# Altium project TC377TP_MK1.PrjPcb
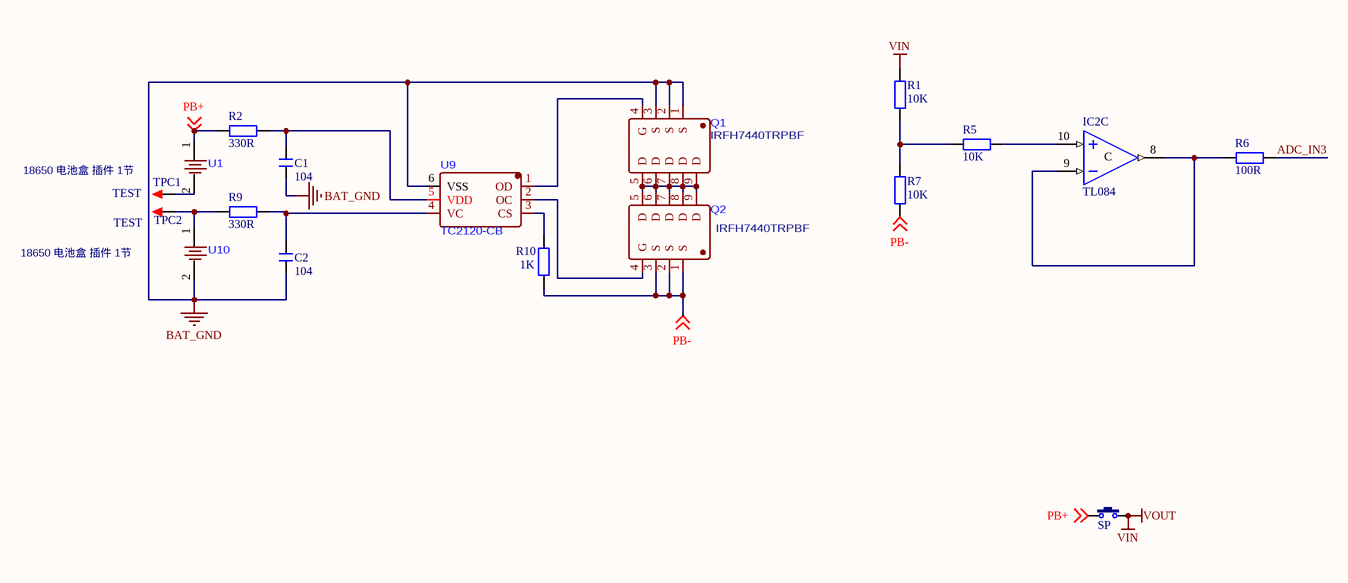
[diagram p0: BAT.SchDoc]
5 sheets, 291 parts. Net scope: global (net labels, ports and power ports of the same name join across sheets).
Board file: PCB_CAR.PcbDoc
Sheets:
  BAT.SchDoc
  MOTOR_DRV.SchDoc
  OTHER.SchDoc
  TC377TP_1.SchDoc
  TC377TP_2.SchDoc

## Sheet BAT.SchDoc
size A3; SheetNumber: 1; SheetTotal: 5

### Parts
C1  104  [C 0805_L]
C2  104  [C 0805_L]
IC2  TL084  [SOP14_N]  (part C of 4)
Q1  IRFH7440TRPBF  [PQFN-8P_L5.8-W4.9-P1.27-LS6.0-BL]
Q2  IRFH7440TRPBF  [PQFN-8P_L5.8-W4.9-P1.27-LS6.0-BL]
R1  10K  [R 0805_L]
R2  330R  [R 0805_L]
R5  10K  [R 0805_L]
R6  100R  [R 0805_L]
R7  10K  [R 0805_L]
R9  330R  [R 0805_L]
R10  1K  [R 0805_L]
SP  6x6x5  [KEY-TH_CN-KCD11]  (value not drawn)
TPC1  TEST  [TEST 1.6]
TPC2  TEST  [TEST 1.6]
U1  18650 电池盒 插件 1节  [BAT-TH_18650-C9900004923]
U9  TC2120-CB  [SOT23-6L]
U10  18650 电池盒 插件 1节  [BAT-TH_18650-C9900004923]

### Nets
BAT_GND: C1.1 C2.1 Q1.1(S) Q1.2(S) Q1.3(S) U9.6(VSS) U10.2
PB-: Q2.1(S) Q2.2(S) Q2.3(S) R7.2 R10.2 ; off-sheet PB-  [project net CORE_GND]
VIN: R1.1 SP.2  [also labelled VOUT]
ADC_IN3: R6.1
PB+: R2.2 SP.1 U1.1 ; off-sheet PB+
NetC1_2: C1.2 R2.1 U9.5(VDD)
NetC2_2: C2.2 R9.1 U9.4(VC)
NetIC2_8: IC2.8(OUT) IC2.9(IN-) R6.2
NetIC2_10: IC2.10(IN+) R5.1
NetQ1_4: Q1.4(G) U9.1(OD)
NetQ1_5: Q1.5(D) Q1.6(D) Q1.7(D) Q1.8(D) Q1.9(D) Q2.5(D) Q2.6(D) Q2.7(D) Q2.8(D) Q2.9(D)
NetQ2_4: Q2.4(G) U9.2(OC)
NetR1_2: R1.2 R5.2 R7.1
NetR9_2: R9.2 TPC2.1 U10.1
NetR10_1: R10.1 U9.3(CS)
NetTPC1_1: TPC1.1 U1.2

### Notes on the sheet
- (in symbol TL084, part C) C

### Library data of the parts
C1 C2 = C: 无极性贴片电容; 版权归属: 源创客; 材质: X7R; BOM名称: 无极性贴片电容; 学习资源: www.ooocke.com
IC2 = TL084: 4路运放; 版权归属: 源创客; BOM名称: 4路运放; 学习资源: www.ooocke.com
R1 R2 R5-R7 R9 R10 = R: 贴片电阻; 版权归属: 源创客; BOM名称: 贴片电阻; 学习资源: www.ooocke.com
SP = TSW DIP-2Pin-6x6: 2脚直插6x6轻触开关; BOM名称: 2脚轻触开关; 版权归属: 源创客; 学习资源: www.ooocke.com
TPC1 TPC2 = TEST: 测试点; 版权归属: 源创客; BOM名称: 测试点; 学习资源: www.ooocke.com

## Sheet MOTOR_DRV.SchDoc
size A3; SheetNumber: 2; SheetTotal: 5
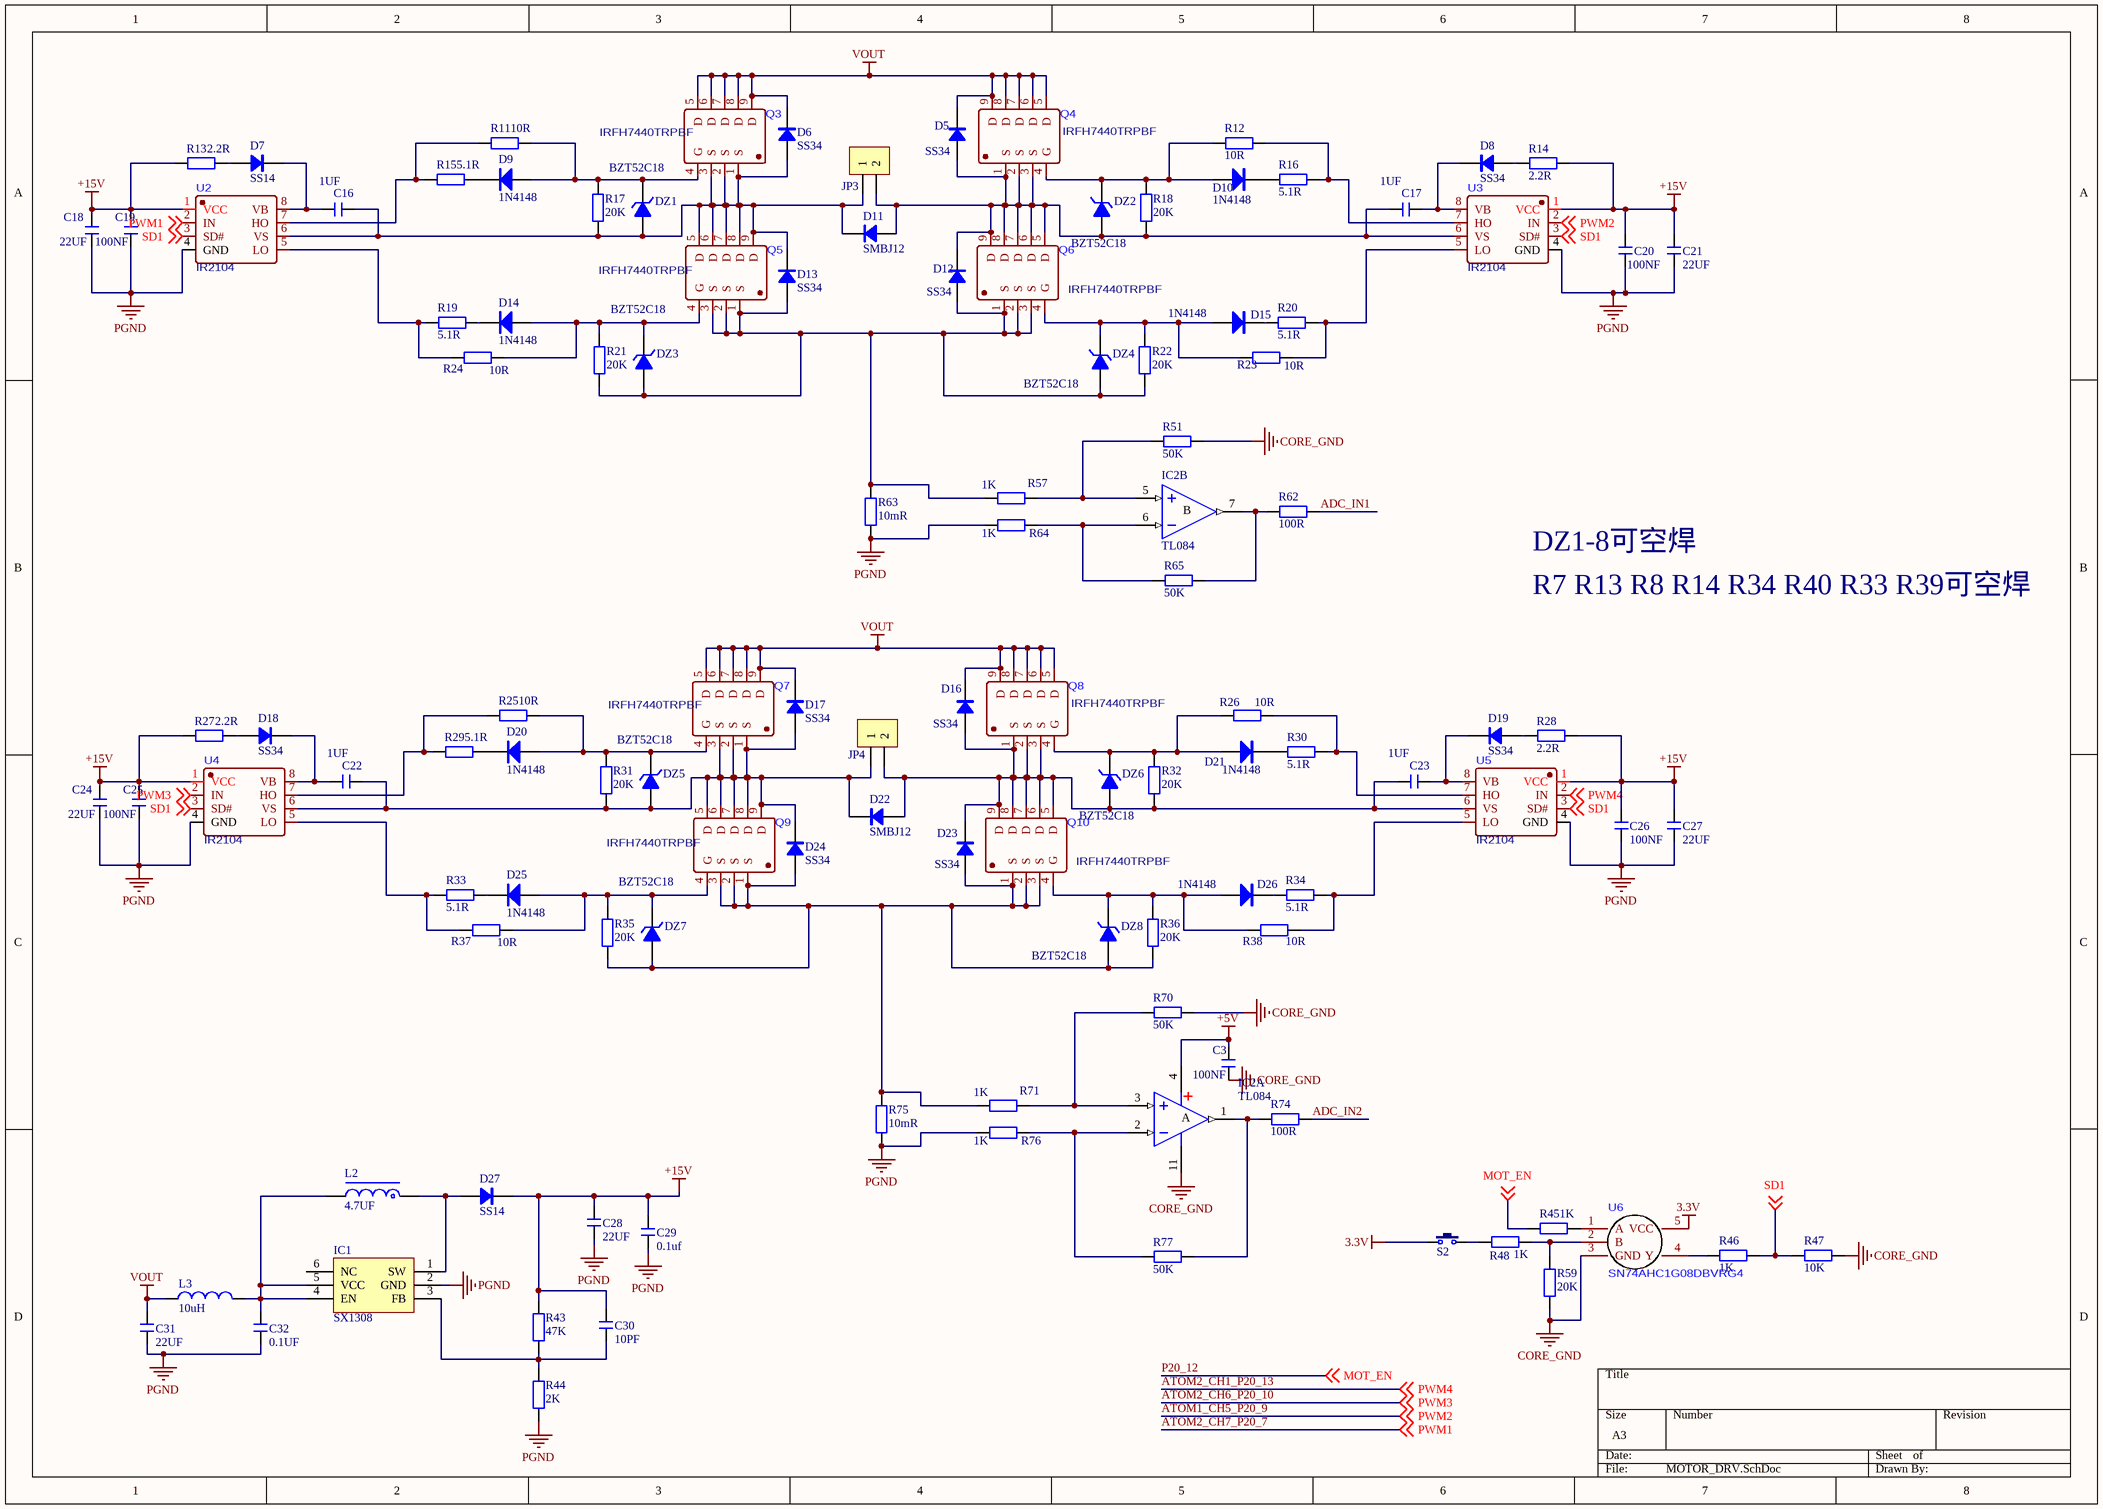
[diagram p1: MOTOR_DRV.SchDoc]

### Parts
C3  100NF  [C 0805_L]
C16  1UF  [C 1206_L]
C17  1UF  [C 1206_L]
C18  22UF  [C 0805_L]
C19  100NF  [C 0805_L]
C20  100NF  [C 0805_L]
C21  22UF  [C 0805_L]
C22  1UF  [C 1206_L]
C23  1UF  [C 1206_L]
C24  22UF  [C 0805_L]
C25  100NF  [C 0805_L]
C26  100NF  [C 0805_L]
C27  22UF  [C 0805_L]
C28  22UF  [C 1206_L]
C29  0.1uf  [C 0805_L]
C30  10PF  [C 0603_L]
C31  22UF  [C 1206_L]
C32  0.1UF  [C 0805_L]
D5  SS34  [SMA]
D6  SS34  [SMA]
D7  SS14  [SOD-123]
D8  SS34  [SOD-123]
D9  1N4148  [SOD-323]
D10  1N4148  [SOD-323]
D11  SMBJ12  [SMA]
D12  SS34  [SMA]
D13  SS34  [SMA]
D14  1N4148  [SOD-323]
D15  1N4148  [SOD-323]
D16  SS34  [SMA]
D17  SS34  [SMA]
D18  SS34  [SOD-123]
D19  SS34  [SOD-123]
D20  1N4148  [SOD-323]
D21  1N4148  [SOD-323]
D22  SMBJ12  [SMA]
D23  SS34  [SMA]
D24  SS34  [SMA]
D25  1N4148  [SOD-323]
D26  1N4148  [SOD-323]
D27  SS14  [SOD-123]
DZ1  BZT52C18  [SOD-323]
DZ2  BZT52C18  [SOD-323]
DZ3  BZT52C18  [SOD-323]
DZ4  BZT52C18  [SOD-323]
DZ5  BZT52C18  [SOD-323]
DZ6  BZT52C18  [SOD-323]
DZ7  BZT52C18  [SOD-323]
DZ8  BZT52C18  [SOD-323]
IC1  SX1308  [SOT23-6N]
IC2  TL084  [SOP14_N]  (parts A,B of 4)
JP3  HDR-1X2  [KF2EDGK5.08-LI-2P]  (value not drawn)
JP4  HDR-1X2  [KF2EDGK5.08-LI-2P]  (value not drawn)
L2  4.7UF  [L-SMD-0420]
L3  10uH  [L 0805_L]
Q3  IRFH7440TRPBF  [PQFN-8P_L5.8-W4.9-P1.27-LS6.0-BL]
Q4  IRFH7440TRPBF  [PQFN-8P_L5.8-W4.9-P1.27-LS6.0-BL]
Q5  IRFH7440TRPBF  [PQFN-8P_L5.8-W4.9-P1.27-LS6.0-BL]
Q6  IRFH7440TRPBF  [PQFN-8P_L5.8-W4.9-P1.27-LS6.0-BL]
Q7  IRFH7440TRPBF  [PQFN-8P_L5.8-W4.9-P1.27-LS6.0-BL]
Q8  IRFH7440TRPBF  [PQFN-8P_L5.8-W4.9-P1.27-LS6.0-BL]
Q9  IRFH7440TRPBF  [PQFN-8P_L5.8-W4.9-P1.27-LS6.0-BL]
Q10  IRFH7440TRPBF  [PQFN-8P_L5.8-W4.9-P1.27-LS6.0-BL]
R11  10R  [R 0805_L]
R12  10R  [R 0805_L]
R13  2.2R  [R 0805_L]
R14  2.2R  [R 0805_L]
R15  5.1R  [R 0805_L]
R16  5.1R  [R 0805_L]
R17  20K  [R 0805_L]
R18  20K  [R 0805_L]
R19  5.1R  [R 0805_L]
R20  5.1R  [R 0805_L]
R21  20K  [R 0805_L]
R22  20K  [R 0805_L]
R23  10R  [R 0805_L]
R24  10R  [R 0805_L]
R25  10R  [R 0805_L]
R26  10R  [R 0805_L]
R27  2.2R  [R 0805_L]
R28  2.2R  [R 0805_L]
R29  5.1R  [R 0805_L]
R30  5.1R  [R 0805_L]
R31  20K  [R 0805_L]
R32  20K  [R 0805_L]
R33  5.1R  [R 0805_L]
R34  5.1R  [R 0805_L]
R35  20K  [R 0805_L]
R36  20K  [R 0805_L]
R37  10R  [R 0805_L]
R38  10R  [R 0805_L]
R43  47K  [R 0805_L]
R44  2K  [R 0805_L]
R45  1K  [R 0805_L]
R46  1K  [R 0805_L]
R47  10K  [R 0805_L]
R48  1K  [R 0805_L]
R51  50K  [R 0805_L]
R57  1K  [R 0805_L]
R59  20K  [R 0805_L]
R62  100R  [R 0805_L]
R63  10mR  [R 2512_M]
R64  1K  [R 0805_L]
R65  50K  [R 0805_L]
R70  50K  [R 0805_L]
R71  1K  [R 0805_L]
R74  100R  [R 0805_L]
R75  10mR  [R 2512_M]
R76  1K  [R 0805_L]
R77  50K  [R 0805_L]
S2  6x6x5  [KEY-TH_CN-KCD11]  (value not drawn)
U2  IR2104  [SOP8_M]
U3  IR2104  [SOP8_M]
U4  IR2104  [SOP8_M]
U5  IR2104  [SOP8_M]
U6  SN74AHC1G08DBVRG4  [SOT23-5L]

### Nets
3.3V: S2.1 U6.5(VCC)
+5V: C3.2 IC2.4(V+)
+15V: C18.2 C19.2 C20.2 C21.2 C24.2 C25.2 C26.2 C27.2 C28.1 C29.1 C30.1 D27.2(K) R13.1 R14.1 R27.1 R28.1 R43.1 U2.1(VCC) U3.1(VCC) U4.1(VCC) U5.1(VCC)
CORE_GND: C3.1 IC2.11(V-) R47.2 R51.1 R59.2 R70.1 U6.3(GND)
PGND: C18.1 C19.1 C20.1 C21.1 C24.1 C25.1 C26.1 C27.1 C28.2 C29.2 C31.2 C32.2 IC1.2(GND) R44.2 R63.1 R64.2 R75.1 R76.2 U2.4(GND) U3.4(GND) U4.4(GND) U5.4(GND)
VOUT: C31.1 D5.2(K) D6.2(K) D16.2(K) D17.2(K) L3.1 Q3.5(D) Q3.6(D) Q3.7(D) Q3.8(D) Q3.9(D) Q4.5(D) Q4.6(D) Q4.7(D) Q4.8(D) Q4.9(D) Q7.5(D) Q7.6(D) Q7.7(D) Q7.8(D) Q7.9(D) Q8.5(D) Q8.6(D) Q8.7(D) Q8.8(D) Q8.9(D)  [project net VIN]
ADC_IN1: R62.1
ADC_IN2: R74.1
ATOM1_CH5_P20_9: U3.2(IN) ; off-sheet PWM2  [also labelled PWM2]
ATOM2_CH1_P20_13: U5.2(IN) ; off-sheet PWM4  [also labelled PWM4]
ATOM2_CH6_P20_10: U4.2(IN) ; off-sheet PWM3  [also labelled PWM3]
ATOM2_CH7_P20_7: U2.2(IN) ; off-sheet PWM1  [also labelled PWM1]
P20_12: R45.2 ; off-sheet MOT_EN  [also labelled MOT_EN]
SD1: R46.2 R47.1 U2.3(SD#) U3.3(SD#) U4.3(SD#) U5.3(SD#) ; off-sheet SD1
NetC16_1: C16.1 D6.1(A) D11.2(K) D13.2(K) DZ1.1(A) JP3.1 Q3.1(S) Q3.2(S) Q3.3(S) Q5.5(D) Q5.6(D) Q5.7(D) Q5.8(D) Q5.9(D) R17.1 U2.6(VS)
NetC16_2: C16.2 D7.2(K) U2.8(VB)
NetC17_1: C17.1 D5.1(A) D11.1(A) D12.2(K) DZ2.1(A) JP3.2 Q4.1(S) Q4.2(S) Q4.3(S) Q6.5(D) Q6.6(D) Q6.7(D) Q6.8(D) Q6.9(D) R18.1 U3.6(VS)
NetC17_2: C17.2 D8.2(K) U3.8(VB)
NetC22_1: C22.1 D17.1(A) D22.2(K) D24.2(K) DZ5.1(A) JP4.1 Q7.1(S) Q7.2(S) Q7.3(S) Q9.5(D) Q9.6(D) Q9.7(D) Q9.8(D) Q9.9(D) R31.1 U4.6(VS)
NetC22_2: C22.2 D18.2(K) U4.8(VB)
NetC23_1: C23.1 D16.1(A) D22.1(A) D23.2(K) DZ6.1(A) JP4.2 Q8.1(S) Q8.2(S) Q8.3(S) Q10.5(D) Q10.6(D) Q10.7(D) Q10.8(D) Q10.9(D) R32.1 U5.6(VS)
NetC23_2: C23.2 D19.2(K) U5.8(VB)
NetC30_2: C30.2 IC1.3(FB) R43.2 R44.1
NetC32_1: C32.1 IC1.4(EN) IC1.5(VCC) L2.2 L3.2
NetD7_1: D7.1(A) R13.2
NetD8_1: D8.1(A) R14.2
NetD9_1: D9.1(A) DZ1.2(K) Q3.4(G) R11.2 R17.2
NetD9_2: D9.2(K) R15.2
NetD10_1: D10.1(A) DZ2.2(K) Q4.4(G) R12.2 R18.2
NetD10_2: D10.2(K) R16.2
NetD12_1: D12.1(A) D13.1(A) DZ3.1(A) DZ4.1(A) Q5.1(S) Q5.2(S) Q5.3(S) Q6.1(S) Q6.2(S) Q6.3(S) R21.1 R22.1 R57.2 R63.2
NetD14_1: D14.1(A) DZ3.2(K) Q5.4(G) R21.2 R24.2
NetD14_2: D14.2(K) R19.2
NetD15_1: D15.1(A) DZ4.2(K) Q6.4(G) R22.2 R23.2
NetD15_2: D15.2(K) R20.2
NetD18_1: D18.1(A) R27.2
NetD19_1: D19.1(A) R28.2
NetD20_1: D20.1(A) DZ5.2(K) Q7.4(G) R25.2 R31.2
NetD20_2: D20.2(K) R29.2
NetD21_1: D21.1(A) DZ6.2(K) Q8.4(G) R26.2 R32.2
NetD21_2: D21.2(K) R30.2
NetD23_1: D23.1(A) D24.1(A) DZ7.1(A) DZ8.1(A) Q9.1(S) Q9.2(S) Q9.3(S) Q10.1(S) Q10.2(S) Q10.3(S) R35.1 R36.1 R71.2 R75.2
NetD25_1: D25.1(A) DZ7.2(K) Q9.4(G) R35.2 R37.2
NetD25_2: D25.2(K) R33.2
NetD26_1: D26.1(A) DZ8.2(K) Q10.4(G) R36.2 R38.2
NetD26_2: D26.2(K) R34.2
NetD27_1: D27.1(A) IC1.1(SW) L2.1
NetIC2_1: IC2.1(OUT) R74.2 R77.1
NetIC2_2: IC2.2(IN-) R76.1 R77.2
NetIC2_3: IC2.3(IN+) R70.2 R71.1
NetIC2_5: IC2.5(IN+) R51.2 R57.1
NetIC2_6: IC2.6(IN-) R64.1 R65.2
NetIC2_7: IC2.7(OUT) R62.2 R65.1
NetR11_1: R11.1 R15.1 U2.7(HO)
NetR12_1: R12.1 R16.1 U3.7(HO)
NetR19_1: R19.1 R24.1 U2.5(LO)
NetR20_1: R20.1 R23.1 U3.5(LO)
NetR25_1: R25.1 R29.1 U4.7(HO)
NetR26_1: R26.1 R30.1 U5.7(HO)
NetR33_1: R33.1 R37.1 U4.5(LO)
NetR34_1: R34.1 R38.1 U5.5(LO)
NetR45_1: R45.1 U6.1(A)
NetR46_1: R46.1 U6.4(Y)
NetR48_1: R48.1 R59.1 U6.2(B)
NetR48_2: R48.2 S2.2

Not connected (* = marked no-connect by the designer): IC1 6(NC)

### Notes on the sheet
- DZ1-8可空焊
- R7 R13 R8 R14 R34 R40 R33 R39可空焊
- (in symbol TL084, part A) A
- (in symbol TL084, part B) B

### Library data of the parts
C3 C16-C32 = C: 无极性贴片电容; 版权归属: 源创客; 材质: X7R; BOM名称: 无极性贴片电容; 学习资源: www.ooocke.com
D5-D8 D11-D13 D16-D19 D22-D24 = SS34: 肖特基二极管; 版权归属: 源创客; 属性: 40V/3A; BOM名称: 肖特基二极管; 学习资源: www.ooocke.com
D9 D10 D14 D15 D20 D21 D25 D26 = 1N4148: 高速开关二极管; 版权归属: 源创客; BOM名称: 高速开关二极管; 学习资源: www.ooocke.com
D27 = SS24: 肖特基二极管; 版权归属: 源创客; 属性: 40V/2A; BOM名称: 肖特基二极管; 学习资源: www.ooocke.com
DZ1-DZ8 = 1N4102: 18V稳压管; BOM名称: 8.7V/0.5W稳压管; 版权归属: 源创客; 学习资源: www.ooocke.com
IC1 = SX1308: 可调升压芯片; 版权归属: 源创客; BOM名称: 可调升压芯片; 学习资源: www.ooocke.com
IC2 = TL084: 4路运放; 版权归属: 源创客; BOM名称: 4路运放; 学习资源: www.ooocke.com
JP3 JP4 = Header 2: 2P接插件; 版权归属: 源创客; BOM名称: 2P接插件; 学习资源: www.ooocke.com
L2 = L-CDRH: 功率屏蔽电感; 版权归属: 源创客; BOM名称: 功率屏蔽电感; 学习资源: www.ooocke.com
L3 = L: 小功率贴片电感; 版权归属: 源创客; BOM名称: 小功率贴片电感; 学习资源: www.ooocke.com
R11-R38 R43-R48 R51 R57 R59 R62-R65 R70 R71 R74-R77 = R: 贴片电阻; 版权归属: 源创客; BOM名称: 贴片电阻; 学习资源: www.ooocke.com
S2 = TSW DIP-2Pin-6x6: 2脚直插6x6轻触开关; BOM名称: 2脚轻触开关; 版权归属: 源创客; 学习资源: www.ooocke.com
U2-U5 = EG2104

## Sheet OTHER.SchDoc
size A3; SheetNumber: 3; SheetTotal: 5
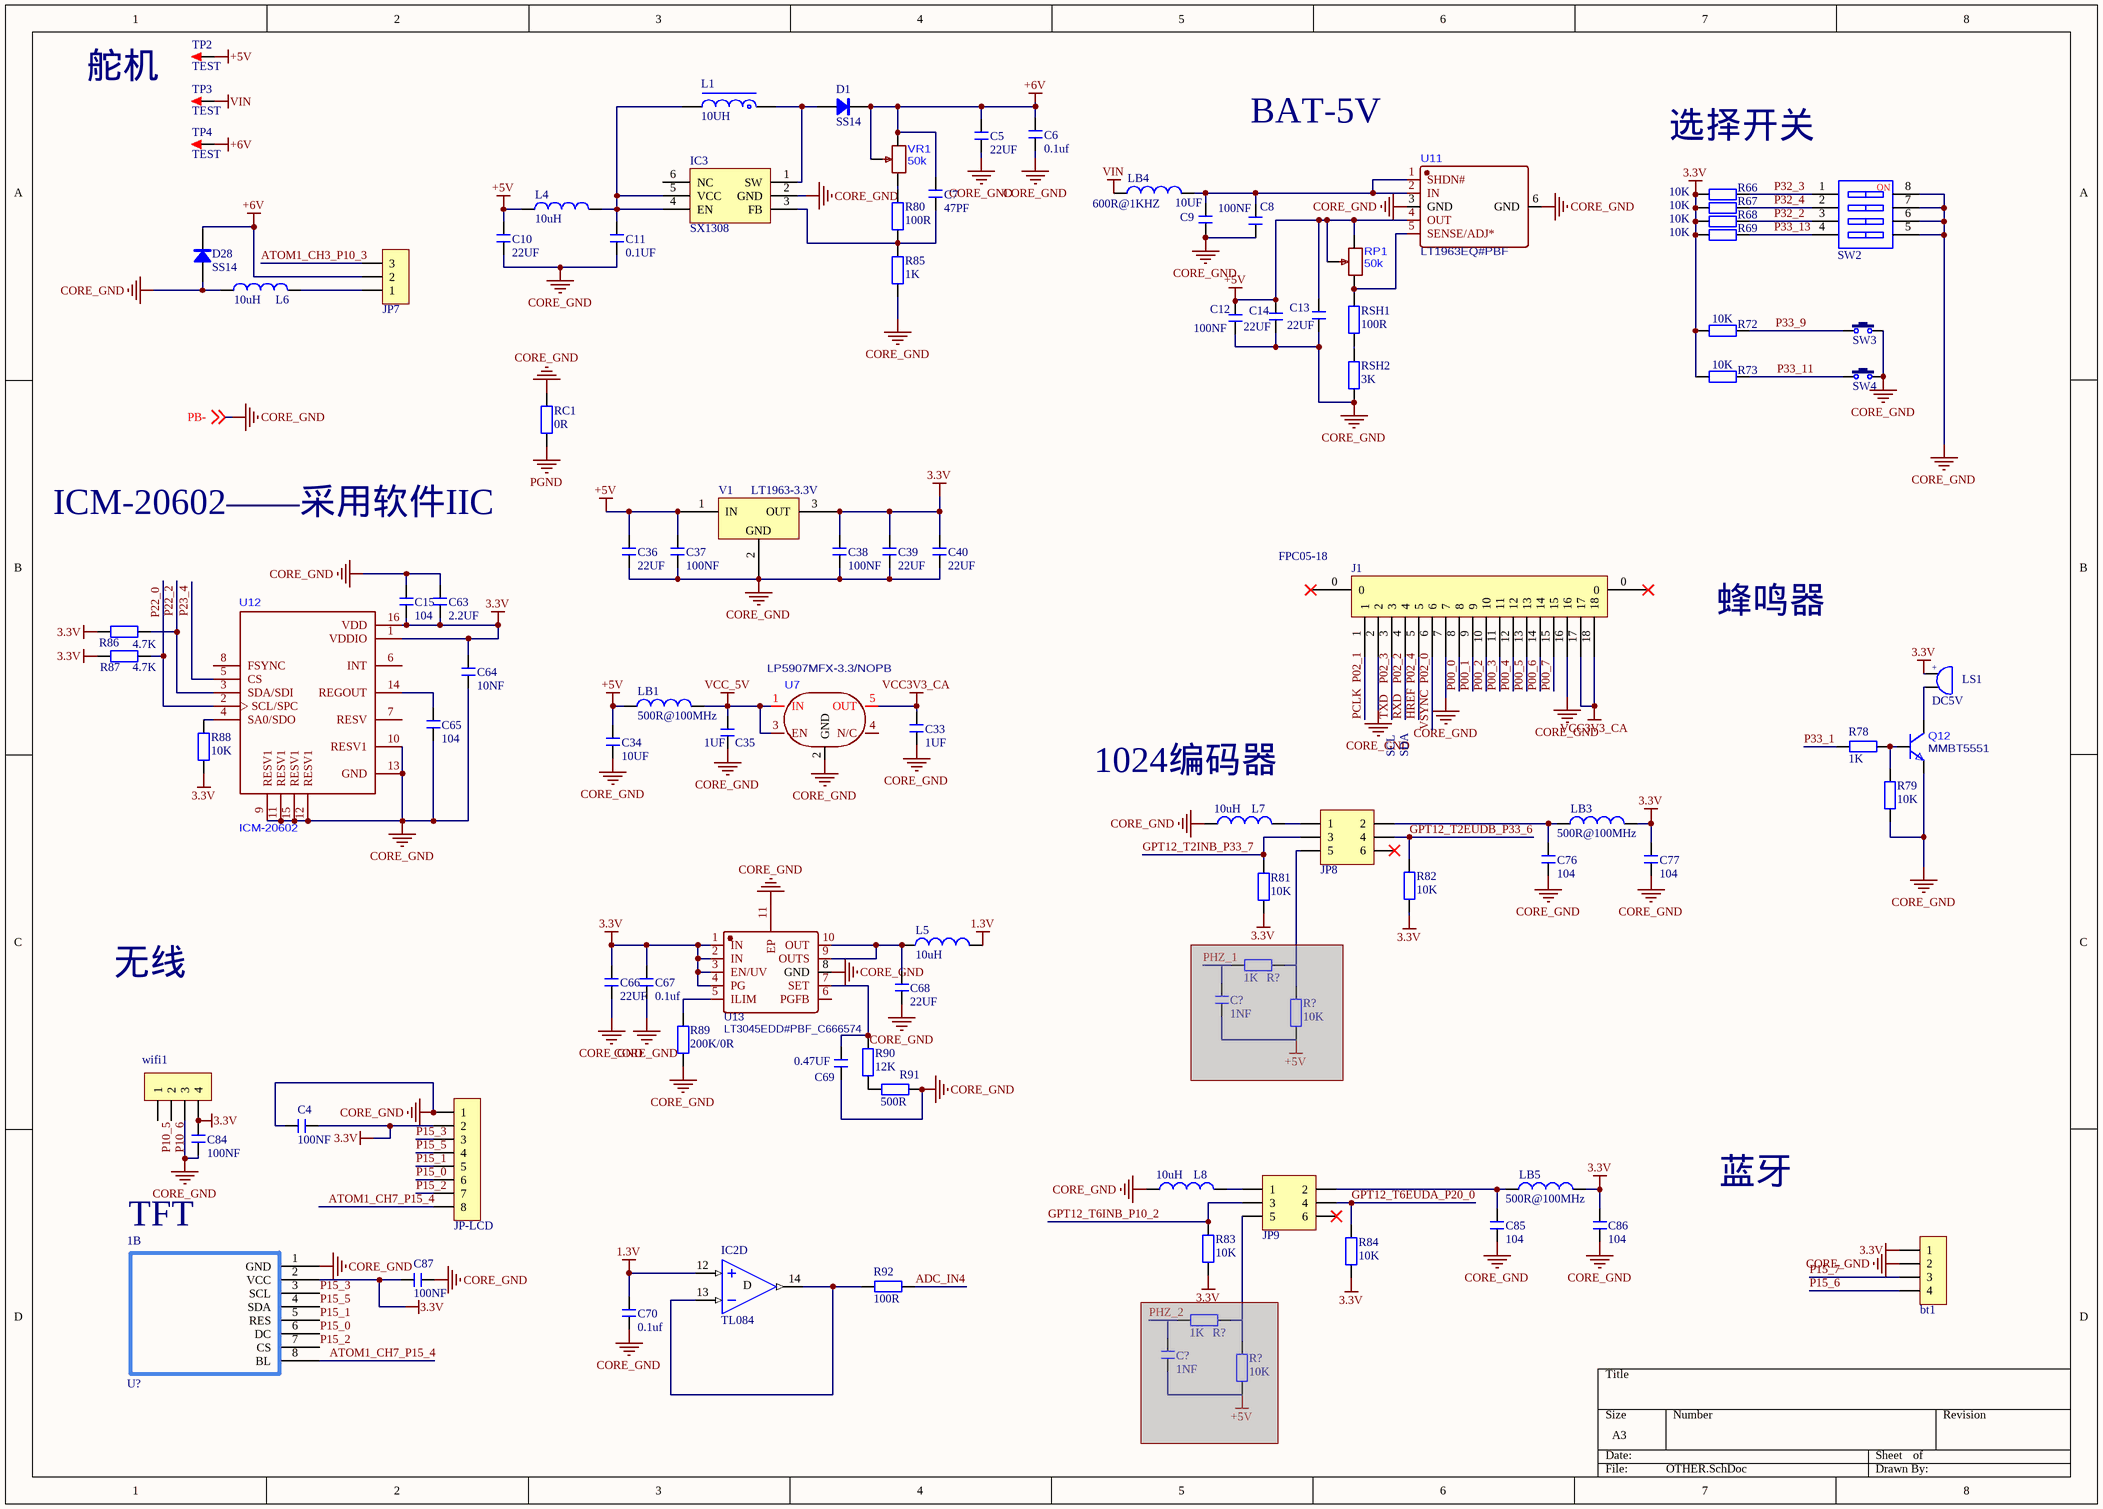
[diagram p2: OTHER.SchDoc]

### Parts
(Parts that share a designator on the sheet are numbered #1, #2 ... from top to bottom, then left to right.)
1  U?  [1.8'TFT]  (part B of 2)
bt1  HDR-1X4  [HDR2.54-LI-4P]  (value not drawn)
C4  100NF  [C 0805_L]
C5  22UF  [C 1206_L]
C6  0.1uf  [C 0805_L]
C7  47PF  [C 0805_L]
C8  100NF  [C 1206_L]
C9  10UF  [C 0805_L]
C10  22UF  [C 1206_L]
C11  0.1UF  [C 0805_L]
C12  100NF  [C 0805_L]
C13  22UF  [C 1206_L]
C14  22UF  [C 1206_L]
C15  104  [C 0603_L]
C33  1UF  [C 0805_L]
C34  10UF  [C 0805_L]
C35  1UF  [C 0805_L]
C36  22UF  [C 1206_L]
C37  100NF  [C 0805_L]
C38  100NF  [C 0805_L]
C39  22UF  [C 1206_L]
C40  22UF  [C 1206_L]
C63  2.2UF  [C 0805_L]
C64  10NF  [C 0805_L]
C65  104  [C 0603_L]
C66  22UF  [C 1206_L]
C67  0.1uf  [C 0805_L]
C68  22UF  [C 1206_L]
C69  0.47UF  [C 0805_L]
C70  0.1uf  [C 0805_L]
C76  104  [C 0805_L]
C77  104  [C 0805_L]
C84  100NF  [C 0805_L]
C85  104  [C 0805_L]
C86  104  [C 0805_L]
C87  100NF  [C 0805_L]
C?#1  1NF  [C 0603_L]  (masked out: inside a compile mask, not in the netlist)
C?#2  1NF  [C 0603_L]  (masked out: inside a compile mask, not in the netlist)
D1  SS14  [SOD-123]
D28  SS14  [SMA]
IC2  TL084  [SOP14_N]  (part D of 4)
IC3  SX1308  [SOT23-6N]
J1  FPC05-18  [FPC-05mm-18]
JP7  HDR-1X3  [XH2.54-LI-3P]  (value not drawn)
JP8  Header3X2  [IDC2.54-LI-2x3P]  (value not drawn)
JP9  Header3X2  [IDC2.54-LI-2x3P]  (value not drawn)
JP-LCD  HDR-1X8  [HDR2.54-LI-8P]  (value not drawn)
L1  10UH  [L-SMD-0420]
L4  10uH  [L 0805_L]
L5  10uH  [L 0805_L]
L6  10uH  [L 0805_L]
L7  10uH  [L 0805_L]
L8  10uH  [L 0805_L]
LB1  500R@100MHz  [FB 0805_L]
LB3  500R@100MHz  [FB 0805_L]
LB4  600R@1KHZ  [L 0805_L]
LB5  500R@100MHz  [FB 0805_L]
LS1  DC5V  [BEEP 5x9x5.5]
Q12  MMBT5551  [SOT23-3L]
R66  10K  [R 0805_L]
R67  10K  [R 0805_L]
R68  10K  [R 0805_L]
R69  10K  [R 0805_L]
R72  10K  [R 0805_L]
R73  10K  [R 0805_L]
R78  1K  [R 0805_L]
R79  10K  [R 0805_L]
R80  100R  [R 0805_L]
R81  10K  [R 0805_L]
R82  10K  [R 0805_L]
R83  10K  [R 0805_L]
R84  10K  [R 0805_L]
R85  1K  [R 0805_L]
R86  4.7K  [R 0805_L]
R87  4.7K  [R 0805_L]
R88  10K  [R 0805_L]
R89  200K/0R  [R 0805_L]
R90  12K  [R 0805_L]
R91  500R  [R 0805_L]
R92  100R  [R 0805_L]
R?#1  1K  [R 0603_L]  (masked out: inside a compile mask, not in the netlist)
R?#2  10K  [R 0603_L]  (masked out: inside a compile mask, not in the netlist)
R?#3  1K  [R 0603_L]  (masked out: inside a compile mask, not in the netlist)
R?#4  10K  [R 0603_L]  (masked out: inside a compile mask, not in the netlist)
RC1  0R  [R 0805_L]
RP1  50k  [RES-ADJ-SMD_3224W]
RSH1  100R  [R 0805_L]
RSH2  3K  [R 0805_L]
SW2  CSW-4P  [CSW DIP-4P]  (value not drawn)
SW3  3x6x5  [TSW SMD-3*6*2.5]  (value not drawn)
SW4  3x6x5  [TSW SMD-3*6*2.5]  (value not drawn)
TP2  TEST  [TEST 1.6]
TP3  TEST  [TEST 1.6]
TP4  TEST  [TEST 1.6]
U7  LP5907MFX-3.3/NOPB  [SOT23-5L]
U11  LT1963EQ#PBF  [DD-PAK-5-leda]
U12  ICM-20602  [LGA-16_L3.0-W3.0-P0.50-BL]
U13  LT3045EDD#PBF_C666574  [LT3045EDD#PBF]
V1  LT1963-3.3V  [SOT223_L]
VR1  50k  [RES-ADJ-SMD_3224W]
wifi1  HDR-1X4  [HDR2.54-LI-4P]  (value not drawn)

### Nets
1.3V: C70.1 IC2.12(IN+) L5.2
3.3V: 1.2(VCC) bt1.1 C4.1 C15.1 C38.2 C39.2 C40.2 C63.1 C64.2 C66.1 C67.1 C77.2 C84.1 C86.2 C87.2 JP-LCD.2 LB3.2 LB5.2 LS1.1 R66.1 R67.1 R68.1 R69.1 R72.1 R73.1 R81.2 R82.2 R83.2 R84.2 R86.2 R87.2 R88.1 U12.1(VDDIO) U12.16(VDD) U13.1(IN) U13.2(IN) U13.3(EN/UV) U13.4(PG) V1.3(OUT) wifi1.4
+5V: C10.1 C12.2 C13.2 C14.2 C34.1 C36.2 C37.2 L4.1 LB1.1 RP1.2 RP1.3 TP2.1 U11.4(OUT) V1.1(IN)
+6V: C5.1 C6.1 C7.1 D1.2(K) D28.2(K) JP7.2 TP4.1 VR1.2 VR1.3
CORE_GND: 1.1(GND) bt1.2 C4.2 C5.2 C6.2 C8.1 C9.1 C10.2 C11.2 C12.1 C13.1 C14.1 C15.2 C33.2 C34.2 C35.2 C36.1 C37.1 C38.1 C39.1 C40.1 C63.2 C64.1 C65.1 C66.2 C67.2 C68.2 C69.2 C70.2 C76.1 C77.1 C84.2 C85.1 C86.1 C87.1 D28.1(A) IC3.2(GND) J1.2 J1.7 J1.16 JP-LCD.1 L6.1 L7.1 L8.1 Q12.2(E) R79.2 R85.2 R89.2 R91.2 RC1.1 RSH2.2 SW2.5 SW2.6 SW2.7 SW2.8 SW3.2 SW4.2 U7.2(GND) U11.3(GND) U11.6(GND) U12.9(RESV1) U12.10(RESV1) U12.11(RESV1) U12.12(RESV1) U12.13(GND) U12.15(RESV1) U13.8(GND) U13.11(EP) V1.2(GND) wifi1.3 ; off-sheet PB-  [also labelled PB-]
PGND: RC1.2
VCC3V3_CA: C33.1 J1.17 J1.18 U7.5(OUT)
VCC_5V: C35.1 LB1.2 U7.1(IN) U7.3(EN)
VIN: LB4.1 TP3.1
ADC_IN4: R92.1
ATOM1_CH3_P10_3: JP7.3
ATOM1_CH7_P15_4: 1.8(BL) JP-LCD.8
GPT12_T2EUDB_P33_6: JP8.4 R82.1
GPT12_T2INB_P33_7: JP8.3 R81.1
GPT12_T6EUDA_P20_0: JP9.4 R84.1
GPT12_T6INB_P10_2: JP9.3 R83.1
HREF: J1.5  [also labelled P02_4]
P00_0: J1.8
P00_1: J1.9
P00_2: J1.10
P00_3: J1.11
P00_4: J1.12
P00_5: J1.13
P00_6: J1.14
P00_7: J1.15
P02_0: J1.6  [also labelled VSYNC]
P02_1: J1.1  [also labelled PCLK]
P02_2: J1.4  [also labelled RXD]
P02_3: J1.3  [also labelled TXD]
P10_5: wifi1.1
P10_6: wifi1.2
P15_0: 1.6(DC) JP-LCD.6
P15_1: 1.5(RES) JP-LCD.5
P15_2: 1.7(CS) JP-LCD.7
P15_3: 1.3(SCL) JP-LCD.3
P15_5: 1.4(SDA) JP-LCD.4
P15_6: bt1.4
P15_7: bt1.3
P22_0: R87.1 U12.2(SCL/SPC)
P22_2: R86.1 U12.3(SDA/SDI)
P23_4: U12.5(CS)
P32_2: R68.2 SW2.3
P32_3: R66.2 SW2.1
P32_4: R67.2 SW2.2
P33_1: R78.2
P33_9: R72.2 SW3.1
P33_11: R73.2 SW4.1
P33_13: R69.2 SW2.4
NetC7_2: C7.2 IC3.3(FB) R80.2 R85.1
NetC8_2: C8.2 C9.2 LB4.2 U11.1(SHDN#) U11.2(IN)
NetC11_1: C11.1 IC3.4(EN) IC3.5(VCC) L1.2 L4.2
NetC65_2: C65.2 U12.14(REGOUT)
NetC68_1: C68.1 L5.1 U13.9(OUTS) U13.10(OUT)
NetC69_1: C69.1 R90.1 U13.7(SET)
NetC76_2: C76.2 JP8.2 LB3.1
NetC85_2: C85.2 JP9.2 LB5.1
NetD1_1: D1.1(A) IC3.1(SW) L1.1
NetIC2_13: IC2.13(IN-) IC2.14(OUT) R92.2
NetJP7_1: JP7.1 L6.2
NetJP8_1: JP8.1 L7.2
NetJP9_1: JP9.1 L8.2
NetLS1_2: LS1.2 Q12.3(C)
NetQ12_1: Q12.1(B) R78.1 R79.1
NetR80_1: R80.1 VR1.1
NetR88_2: R88.2 U12.4(SA0/SDO)
NetR89_1: R89.1 U13.5(ILIM)
NetR90_2: R90.2 R91.1
NetRP1_1: RP1.1 RSH1.1 U11.5(SENSE/ADJ*)
NetRSH1_2: RSH1.2 RSH2.1

Not connected (* = marked no-connect by the designer): IC3 6(NC); J1 0*; JP8 5 6*; JP9 5 6*; U7 4(N/C); U12 6(INT) 7(RESV) 8(FSYNC); U13 6(PGFB)

### Notes on the sheet
- 舵机
- BAT-5V
- 选择开关
- ICM-20602——采用软件IIC
- 蜂鸣器
- (near L7) 1024编码器
- SCL
- SDA
- 无线
- 蓝牙
- TFT
- (in symbol BEEP) +
- (in symbol CSW-4P) NO
- (in symbol TL084, part D) D

### Library data of the parts
1 = 1.8'TFT
bt1 wifi1 = Header 4: 4P接插件; 版权归属: 源创客; BOM名称: 4P接插件; 学习资源: www.ooocke.com
C4-C15 C33-C40 C63-C70 C76 C77 C84-C87 C?#1 C?#2 = C: 无极性贴片电容; 版权归属: 源创客; 材质: X7R; BOM名称: 无极性贴片电容; 学习资源: www.ooocke.com
D1 D28 = SS24: 肖特基二极管; 版权归属: 源创客; 属性: 40V/2A; BOM名称: 肖特基二极管; 学习资源: www.ooocke.com
IC2 = TL084: 4路运放; 版权归属: 源创客; BOM名称: 4路运放; 学习资源: www.ooocke.com
IC3 = SX1308: 可调升压芯片; 版权归属: 源创客; BOM名称: 可调升压芯片; 学习资源: www.ooocke.com
JP7 = Header 3: 3P接插件; 版权归属: 源创客; BOM名称: 3P接插件; 学习资源: www.ooocke.com
JP8 JP9 = Header 3X2: 3*2P接插件; 版权归属: 源创客; BOM名称: 3*2P接插件; 学习资源: www.ooocke.com
JP-LCD = Header 8: 8P接插件; 版权归属: 源创客; BOM名称: 8P接插件; 学习资源: www.ooocke.com
L1 = L-CDRH: 功率屏蔽电感; 版权归属: 源创客; BOM名称: 功率屏蔽电感; 学习资源: www.ooocke.com
L4-L8 = L: 小功率贴片电感; 版权归属: 源创客; BOM名称: 小功率贴片电感; 学习资源: www.ooocke.com
LB1 LB3-LB5 = LB: 磁珠; 版权归属: 源创客; BOM名称: 磁珠; 学习资源: www.ooocke.com
LS1 = BEEP: 蜂鸣器; 版权归属: 源创客; BOM名称: 蜂鸣器; 学习资源: www.ooocke.com
R66-R69 R72 R73 R78-R92 R?#1-R?#4 RC1 RSH1 RSH2 = R: 贴片电阻; 版权归属: 源创客; BOM名称: 贴片电阻; 学习资源: www.ooocke.com
RP1 VR1 = 3224W-1-503E
SW2 = CSW-4P: 4路编码开关; 版权归属: 源创客; BOM名称: 4路编码开关; 学习资源: www.ooocke.com
SW3 SW4 = TSW 3x6: 3x6轻触开关; 版权归属: 源创客; BOM名称: 3x6轻触开关; 学习资源: www.ooocke.com
TP2-TP4 = TEST: 测试点; 版权归属: 源创客; BOM名称: 测试点; 学习资源: www.ooocke.com
U7 = LP5907MFX-1.8/NOPB
U13 = LT3045EDD#PBF_C666574: BOM_Manufacturer: Analog Devices; Contributor: LCSC; BOM_Supplier: LCSC; BOM_Supplier Part: C666574; BOM_Manufacturer Part: LT3045EDD#PBF; BOM_JLCPCB Part Class: Extended Part; spicePre: U; spiceSymbolName: LT3045EDD#PBF_C666574
V1 = LM2940: 5V稳压芯片; 版权归属: 源创客; BOM名称: 5V稳压芯片; 学习资源: www.ooocke.com

## Sheet TC377TP_1.SchDoc
size A4; SheetNumber: 4; SheetTotal: 5
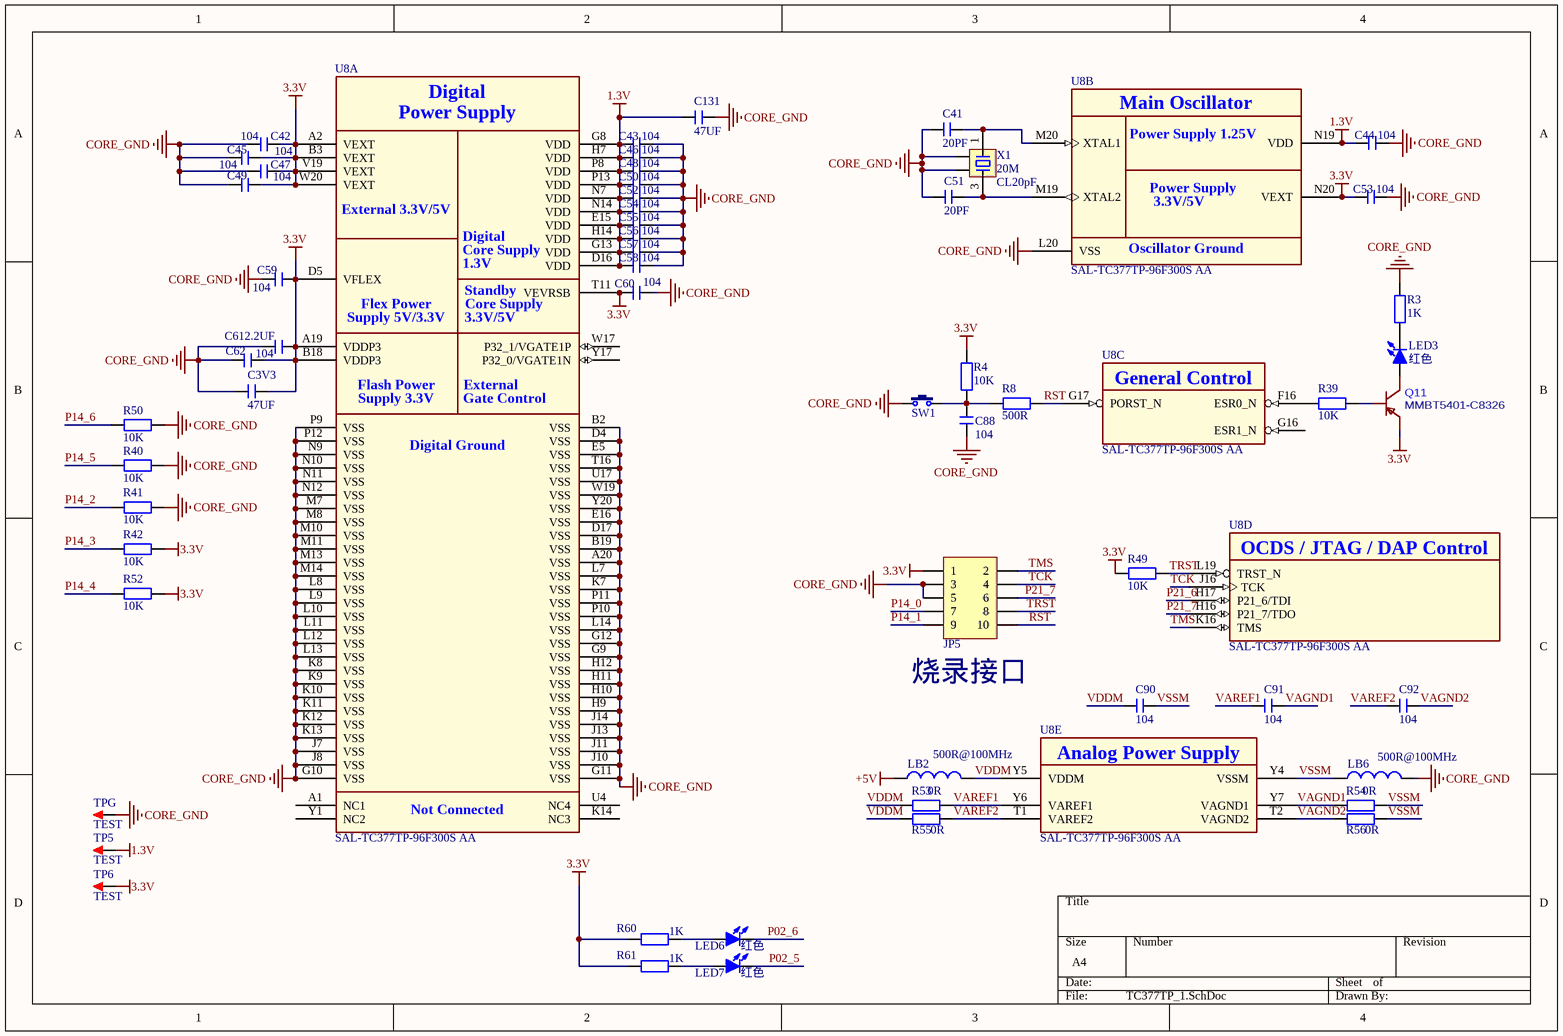
[diagram p3: TC377TP_1.SchDoc]

### Parts
C3V3  47UF  [C 0805_L]
C41  20PF  [C 0603_L]
C42  104  [C 0603_L]
C43  104  [C 0603_L]
C44  104  [C 0603_L]
C45  104  [C 0603_L]
C46  104  [C 0603_L]
C47  104  [C 0603_L]
C48  104  [C 0603_L]
C49  104  [C 0603_L]
C50  104  [C 0603_L]
C51  20PF  [C 0603_L]
C52  104  [C 0603_L]
C53  104  [C 0603_L]
C54  104  [C 0603_L]
C55  104  [C 0603_L]
C56  104  [C 0603_L]
C57  104  [C 0603_L]
C58  104  [C 0603_L]
C59  104  [C 0603_L]
C60  104  [C 0603_L]
C61  2.2UF  [C 0603_L]
C62  104  [C 0603_L]
C88  104  [C 0603_L]
C90  104  [C 0603_L]
C91  104  [C 0603_L]
C92  104  [C 0603_L]
C131  47UF  [C 0805_L]
JP5  Header 5X2  [IDC2.54-LI-2x5P]  (value not drawn)
LB2  500R@100MHz  [FB 0603_L]
LB6  500R@100MHz  [FB 0603_L]
LED3  红色  [LED 0603Y]
LED6  红色  [LED 0603Y]
LED7  红色  [LED 0603Y]
Q11  MMBT5401-C8326  [SOT23-3L]
R3  1K  [R 0603_L]
R4  10K  [R 0603_L]
R8  500R  [R 0603_L]
R39  10K  [R 0603_L]
R40  10K  [R 0603_L]
R41  10K  [R 0603_L]
R42  10K  [R 0603_L]
R49  10K  [R 0805_L]
R50  10K  [R 0603_L]
R52  10K  [R 0603_L]
R53  0R  [R 0603_L]
R54  0R  [R 0603_L]
R55  0R  [R 0603_L]
R56  0R  [R 0603_L]
R60  1K  [R 0603_L]
R61  1K  [R 0603_L]
SW1  3x6x5  [TSW SMD-3*6*2.5]  (value not drawn)
TP5  TEST  [TEST 1.6]
TP6  TEST  [TEST 1.6]
TPG  TEST  [TEST 1.6]
U8  SAL-TC377TP-96F300S AA  [BGA292C80P20X20]  (parts A,B,C,D,E of 13)
X1  20M  负载电容: CL20pF  [OSC 3225-4P]

### Nets
1.3V: C43.2 C44.2 C46.2 C48.2 C50.2 C52.2 C54.2 C55.2 C56.2 C57.2 C58.2 C131.2 TP5.1 U8.D16(VDD) U8.E15(VDD) U8.G8(VDD) U8.G13(VDD) U8.H7(VDD) U8.H14(VDD) U8.N7(VDD) U8.N14(VDD) U8.N19(VDD) U8.P8(VDD) U8.P13(VDD)
3.3V: C3V3.2 C42.1 C45.1 C47.1 C49.1 C53.2 C59.1 C60.2 C61.1 C62.1 JP5.1 Q11.2(E) R4.2 R42.2 R49.2 R52.2 R60.2 R61.2 TP6.1 U8.A2(VEXT) U8.A19(VDDP3) U8.B3(VEXT) U8.B18(VDDP3) U8.D5(VFLEX) U8.N20(VEXT) U8.T11(VEVRSB) U8.V19(VEXT) U8.W20(VEXT)
+5V: LB2.1
CORE_GND: C3V3.1 C41.2 C42.2 C43.1 C44.1 C45.2 C46.1 C47.2 C48.1 C49.2 C50.1 C51.2 C52.1 C53.1 C54.1 C55.1 C56.1 C57.1 C58.1 C59.2 C60.1 C61.2 C62.2 C88.1 C131.1 JP5.3 JP5.5 LB6.2 R3.1 R40.2 R41.2 R50.2 SW1.1 TPG.1 U8.A20(VSS) U8.B2(VSS) U8.B19(VSS) U8.D4(VSS) U8.D17(VSS) U8.E5(VSS) U8.E16(VSS) U8.G9(VSS) U8.G10(VSS) U8.G11(VSS) U8.G12(VSS) U8.H9(VSS) U8.H10(VSS) U8.H11(VSS) U8.H12(VSS) U8.J7(VSS) U8.J8(VSS) U8.J10(VSS) U8.J11(VSS) U8.J13(VSS) U8.J14(VSS) U8.K7(VSS) U8.K8(VSS) U8.K9(VSS) U8.K10(VSS) U8.K11(VSS) U8.K12(VSS) U8.K13(VSS) U8.L7(VSS) U8.L8(VSS) U8.L9(VSS) U8.L10(VSS) U8.L11(VSS) U8.L12(VSS) U8.L13(VSS) U8.L14(VSS) U8.L20(VSS) U8.M7(VSS) U8.M8(VSS) U8.M10(VSS) U8.M11(VSS) U8.M13(VSS) U8.M14(VSS) U8.N9(VSS) U8.N10(VSS) U8.N11(VSS) U8.N12(VSS) U8.P9(VSS) U8.P10(VSS) U8.P11(VSS) U8.P12(VSS) U8.T16(VSS) U8.U17(VSS) U8.W19(VSS) U8.Y20(VSS) X1.2 X1.4
P02_5: LED7.2(K)
P02_6: LED6.2(K)
P14_0: JP5.7
P14_1: JP5.9
P14_2: R41.1
P14_3: R42.1
P14_4: R52.1
P14_5: R40.1
P14_6: R50.1
P21_6: U8.H17(P21_6/TDI)
P21_7: JP5.6 U8.H16(P21_7/TDO)
RST: JP5.10 R8.2 U8.G17(PORST_N)
TCK: JP5.4 U8.J16(TCK)
TMS: JP5.2 U8.K16(TMS)
TRST: JP5.8 R49.1 U8.L19(TRST_N)
VAGND1: C91.1 R54.1 U8.Y7(VAGND1)
VAGND2: C92.1 R56.1 U8.T2(VAGND2)
VAREF1: C91.2 R53.2 U8.Y6(VAREF1)
VAREF2: C92.2 R55.2 U8.T1(VAREF2)
VDDM: C90.2 LB2.2 R53.1 R55.1 U8.Y5(VDDM)
VSSM: C90.1 LB6.1 R54.2 R56.2 U8.Y4(VSSM)
NetC41_1: C41.1 U8.M20(XTAL1) X1.1
NetC51_1: C51.1 U8.M19(XTAL2) X1.3
NetC88_2: C88.2 R4.1 R8.1 SW1.2
NetLED3_1: LED3.1(A) Q11.3(C)
NetLED3_2: LED3.2(K) R3.2
NetLED6_1: LED6.1(A) R60.1
NetLED7_1: LED7.1(A) R61.1
NetQ11_1: Q11.1(B) R39.1
NetR39_2: R39.2 U8.F16(ESR0_N)

Not connected (* = marked no-connect by the designer): U8 A1(NC1) G16(ESR1_N) K14(NC3) U4(NC4) W17(P32_1/VGATE1P) Y1(NC2) Y17(P32_0/VGATE1N)

### Notes on the sheet
- (near JP5) 烧录接口
- (in symbol SAL-TC377TP-96F300S AA, part A) Digital; Power Supply; External 3.3V/5V; Core Supply; 1.3V; Standby; Flex Power; Supply 5V/3.3V; 3.3V/5V; Flash Power; External; Supply 3.3V; Gate Control; Digital Ground; Not Connected
- (in symbol SAL-TC377TP-96F300S AA, part B) Main Oscillator; Power Supply 1.25V; Power Supply; 3.3V/5V; Oscillator Ground
- (in symbol SAL-TC377TP-96F300S AA, part C) General Control
- (in symbol SAL-TC377TP-96F300S AA, part D) OCDS / JTAG / DAP Control
- (in symbol SAL-TC377TP-96F300S AA, part E) Analog Power Supply

### Library data of the parts
C3V3 C41-C62 C88 C90-C92 C131 = C: 无极性贴片电容; 版权归属: 源创客; 材质: X7R; BOM名称: 无极性贴片电容; 学习资源: www.ooocke.com
JP5 = Header 5X2: 5*2P接插件; 版权归属: 源创客; BOM名称: 5*2P接插件; 学习资源: www.ooocke.com
LB2 LB6 = LB: 磁珠; 版权归属: 源创客; BOM名称: 磁珠; 学习资源: www.ooocke.com
LED3 LED6 LED7 = LED-SMD: 贴片LED; 版权归属: 源创客; BOM名称: 贴片LED; 学习资源: www.ooocke.com
R3 R4 R8 R39-R42 R49 R50 R52-R56 R60 R61 = R: 贴片电阻; 版权归属: 源创客; BOM名称: 贴片电阻; 学习资源: www.ooocke.com
SW1 = TSW 3x6: 3x6轻触开关; 版权归属: 源创客; BOM名称: 3x6轻触开关; 学习资源: www.ooocke.com
TP5 TP6 TPG = TEST: 测试点; 版权归属: 源创客; BOM名称: 测试点; 学习资源: www.ooocke.com
U8 = SAL-TC377TP-96F300S AA: 32-Bit Single-Chip Microcontroller; Manufacturer: Infineon Technologies; Manufacturer Order Number: SAL-TC377TP-96F300S AA; PackageReference: PG-LFBGA-292-11
X1 = XTAL-4P: 4脚无源晶振; 版权归属: 源创客; BOM名称: 4脚无源晶振; 学习资源: www.ooocke.com

## Sheet TC377TP_2.SchDoc
size A4; SheetNumber: 5; SheetTotal: 5
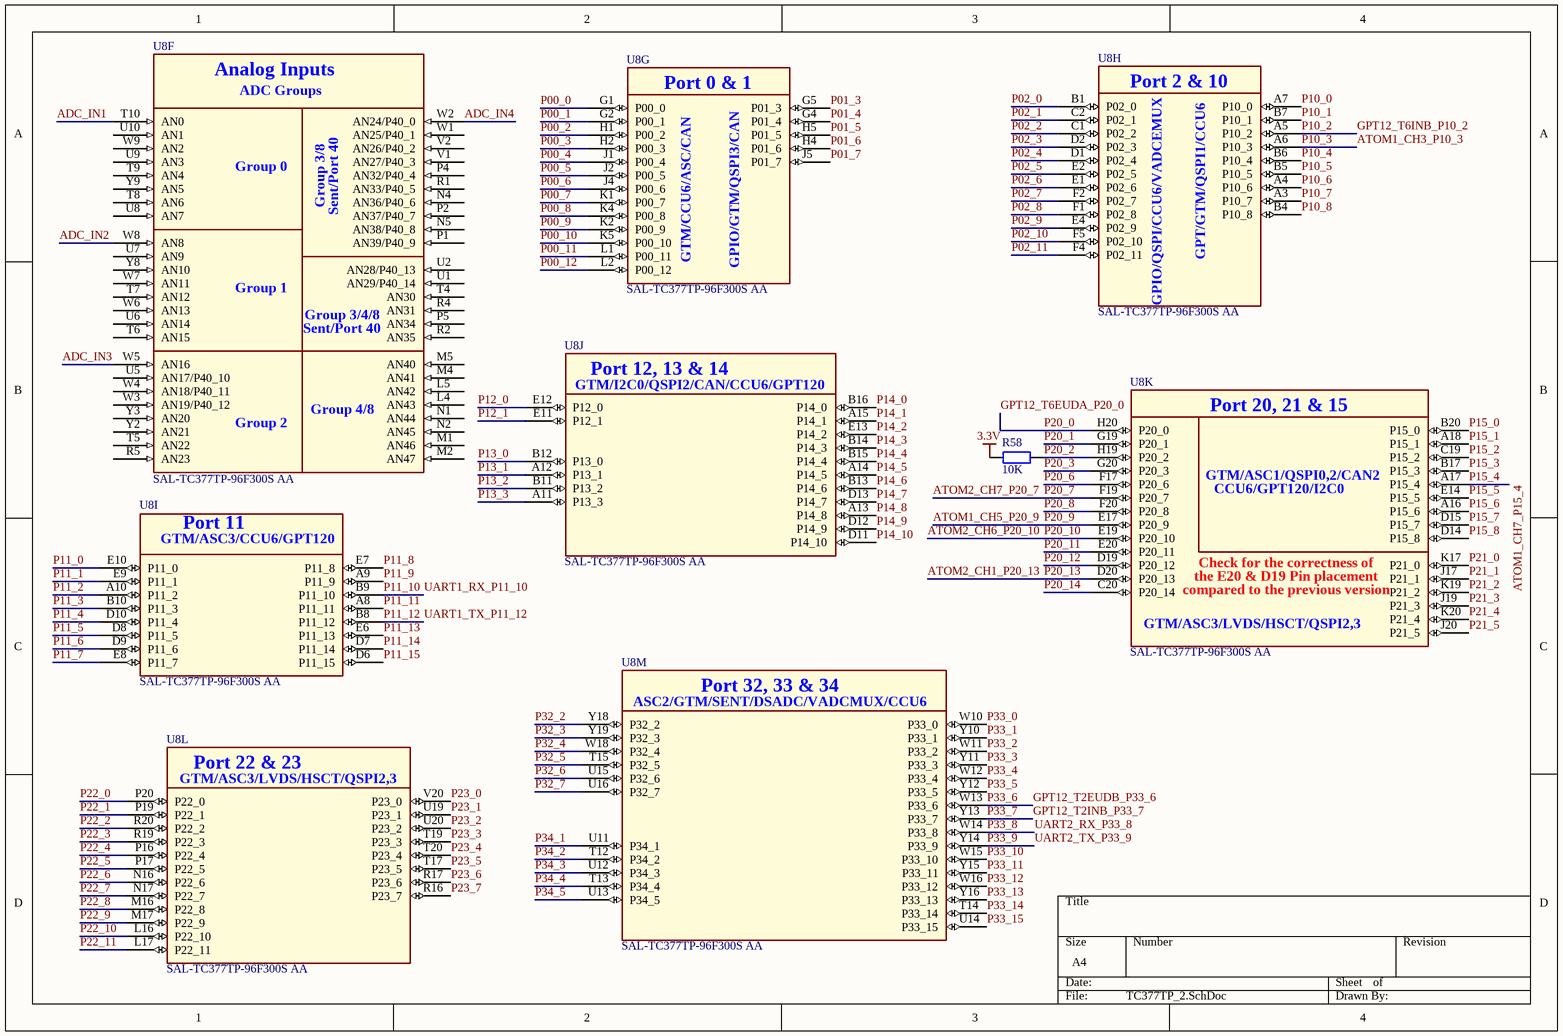
[diagram p4: TC377TP_2.SchDoc]

### Parts
R58  10K  [R 0603_L]
U8  SAL-TC377TP-96F300S AA  [BGA292C80P20X20]  (parts F,G,H,I,J,K,L,M of 13)

### Nets
3.3V: R58.2
ADC_IN1: U8.T10(AN0)
ADC_IN2: U8.W8(AN8)
ADC_IN3: U8.W5(AN16)
ADC_IN4: U8.W2(AN24/P40_0)
ATOM1_CH3_P10_3: U8.A6(P10_3)  [also labelled P10_3]
ATOM1_CH5_P20_9: U8.E17(P20_9)  [also labelled P20_9]
ATOM1_CH7_P15_4: U8.A17(P15_4)  [also labelled P15_4]
ATOM2_CH1_P20_13: U8.D20(P20_13)  [also labelled P20_13]
ATOM2_CH6_P20_10: U8.E19(P20_10)  [also labelled P20_10]
ATOM2_CH7_P20_7: U8.F19(P20_7)  [also labelled P20_7]
GPT12_T2EUDB_P33_6: U8.W13(P33_6)  [also labelled P33_6]
GPT12_T2INB_P33_7: U8.Y13(P33_7)  [also labelled P33_7]
GPT12_T6EUDA_P20_0: U8.H20(P20_0)  [also labelled P20_0]
GPT12_T6INB_P10_2: U8.A5(P10_2)  [also labelled P10_2]
P00_0: U8.G1(P00_0)
P00_1: U8.G2(P00_1)
P00_2: U8.H1(P00_2)
P00_3: U8.H2(P00_3)
P00_4: U8.J1(P00_4)
P00_5: U8.J2(P00_5)
P00_6: U8.J4(P00_6)
P00_7: U8.K1(P00_7)
P00_8: U8.K4(P00_8)
P00_9: U8.K2(P00_9)
P00_10: U8.K5(P00_10)
P00_11: U8.L1(P00_11)
P00_12: U8.L2(P00_12)
P01_3: U8.G5(P01_3)
P01_4: U8.G4(P01_4)
P01_5: U8.H5(P01_5)
P01_6: U8.H4(P01_6)
P01_7: U8.J5(P01_7)
P02_0: U8.B1(P02_0)
P02_1: U8.C2(P02_1)
P02_2: U8.C1(P02_2)
P02_3: U8.D2(P02_3)
P02_4: U8.D1(P02_4)  [project net HREF]
P02_5: U8.E2(P02_5)
P02_6: U8.E1(P02_6)
P02_7: U8.F2(P02_7)
P02_8: U8.F1(P02_8)
P02_9: U8.E4(P02_9)
P02_10: U8.F5(P02_10)
P02_11: U8.F4(P02_11)
P10_0: U8.A7(P10_0)
P10_1: U8.B7(P10_1)
P10_4: U8.B6(P10_4)
P10_5: U8.B5(P10_5)
P10_6: U8.A4(P10_6)
P10_7: U8.A3(P10_7)
P10_8: U8.B4(P10_8)
P11_0: U8.E10(P11_0)
P11_1: U8.E9(P11_1)
P11_2: U8.A10(P11_2)
P11_3: U8.B10(P11_3)
P11_4: U8.D10(P11_4)
P11_5: U8.D8(P11_5)
P11_6: U8.D9(P11_6)
P11_7: U8.E8(P11_7)
P11_8: U8.E7(P11_8)
P11_9: U8.A9(P11_9)
P11_10: U8.B9(P11_10)  [also labelled UART1_RX_P11_10]
P11_11: U8.A8(P11_11)
P11_12: U8.B8(P11_12)  [also labelled UART1_TX_P11_12]
P11_13: U8.E6(P11_13)
P11_14: U8.D7(P11_14)
P11_15: U8.D6(P11_15)
P12_0: U8.E12(P12_0)
P12_1: U8.E11(P12_1)
P13_0: U8.B12(P13_0)
P13_1: U8.A12(P13_1)
P13_2: U8.B11(P13_2)
P13_3: U8.A11(P13_3)
P14_0: U8.B16(P14_0)
P14_1: U8.A15(P14_1)
P14_2: U8.E13(P14_2)
P14_3: U8.B14(P14_3)
P14_4: U8.B15(P14_4)
P14_5: U8.A14(P14_5)
P14_6: U8.B13(P14_6)
P14_7: U8.D13(P14_7)
P14_8: U8.A13(P14_8)
P14_9: U8.D12(P14_9)
P14_10: U8.D11(P14_10)
P15_0: U8.B20(P15_0)
P15_1: U8.A18(P15_1)
P15_2: U8.C19(P15_2)
P15_3: U8.B17(P15_3)
P15_5: U8.E14(P15_5)
P15_6: U8.A16(P15_6)
P15_7: U8.D15(P15_7)
P15_8: U8.D14(P15_8)
P20_1: U8.G19(P20_1)
P20_2: R58.1 U8.H19(P20_2)
P20_3: U8.G20(P20_3)
P20_6: U8.F17(P20_6)
P20_8: U8.F20(P20_8)
P20_11: U8.E20(P20_11)
P20_12: U8.D19(P20_12)
P20_14: U8.C20(P20_14)
P21_0: U8.K17(P21_0)
P21_1: U8.J17(P21_1)
P21_2: U8.K19(P21_2)
P21_3: U8.J19(P21_3)
P21_4: U8.K20(P21_4)
P21_5: U8.J20(P21_5)
P22_0: U8.P20(P22_0)
P22_1: U8.P19(P22_1)
P22_2: U8.R20(P22_2)
P22_3: U8.R19(P22_3)
P22_4: U8.P16(P22_4)
P22_5: U8.P17(P22_5)
P22_6: U8.N16(P22_6)
P22_7: U8.N17(P22_7)
P22_8: U8.M16(P22_8)
P22_9: U8.M17(P22_9)
P22_10: U8.L16(P22_10)
P22_11: U8.L17(P22_11)
P23_0: U8.V20(P23_0)
P23_1: U8.U19(P23_1)
P23_2: U8.U20(P23_2)
P23_3: U8.T19(P23_3)
P23_4: U8.T20(P23_4)
P23_5: U8.T17(P23_5)
P23_6: U8.R17(P23_6)
P23_7: U8.R16(P23_7)
P32_2: U8.Y18(P32_2)
P32_3: U8.Y19(P32_3)
P32_4: U8.W18(P32_4)
P32_5: U8.T15(P32_5)
P32_6: U8.U15(P32_6)
P32_7: U8.U16(P32_7)
P33_0: U8.W10(P33_0)
P33_1: U8.Y10(P33_1)
P33_2: U8.W11(P33_2)
P33_3: U8.Y11(P33_3)
P33_4: U8.W12(P33_4)
P33_5: U8.Y12(P33_5)
P33_8: U8.W14(P33_8)  [also labelled UART2_RX_P33_8]
P33_9: U8.Y14(P33_9)  [also labelled UART2_TX_P33_9]
P33_10: U8.W15(P33_10)
P33_11: U8.Y15(P33_11)
P33_12: U8.W16(P33_12)
P33_13: U8.Y16(P33_13)
P33_14: U8.T14(P33_14)
P33_15: U8.U14(P33_15)
P34_1: U8.U11(P34_1)
P34_2: U8.T12(P34_2)
P34_3: U8.U12(P34_3)
P34_4: U8.T13(P34_4)
P34_5: U8.U13(P34_5)

Not connected (* = marked no-connect by the designer): U8 L4(AN43) L5(AN42) M1(AN46) M2(AN47) M4(AN41) M5(AN40) N1(AN44) N2(AN45) N4(AN36/P40_6) N5(AN38/P40_8) P1(AN39/P40_9) P2(AN37/P40_7) P4(AN32/P40_4) P5(AN34) R1(AN33/P40_5) R2(AN35) R4(AN31) R5(AN23) T4(AN30) T5(AN22) T6(AN15) T7(AN12) T8(AN6) T9(AN4) U1(AN29/P40_14) U2(AN28/P40_13) U5(AN17/P40_10) U6(AN14) U7(AN9) U8(AN7) U9(AN3) U10(AN1) V1(AN27/P40_3) V2(AN26/P40_2) W1(AN25/P40_1) W3(AN19/P40_12) W4(AN18/P40_11) W6(AN13) W7(AN11) W9(AN2) Y2(AN21) Y3(AN20) Y8(AN10) Y9(AN5)

### Notes on the sheet
- (in symbol SAL-TC377TP-96F300S AA, part F) Analog Inputs; ADC Groups; Group 0; Group 3/8; Sent/Port 40; Group 1; Group 3/4/8; Group 4/8; Group 2
- (in symbol SAL-TC377TP-96F300S AA, part G) Port 0 & 1; GTM/CCU6/ASC/CAN; GPIO/GTM/QSPI3/CAN
- (in symbol SAL-TC377TP-96F300S AA, part H) Port 2 & 10; GPT/GTM/QSPI1/CCU6; GPIO/QSPI/CCU6/VADCEMUX
- (in symbol SAL-TC377TP-96F300S AA, part I) Port 11; GTM/ASC3/CCU6/GPT120
- (in symbol SAL-TC377TP-96F300S AA, part J) Port 12, 13 & 14; GTM/I2C0/QSPI2/CAN/CCU6/GPT120
- (in symbol SAL-TC377TP-96F300S AA, part K) Port 20, 21 & 15; GTM/ASC1/QSPI0,2/CAN2; CCU6/GPT120/I2C0; Check for the correctness of; the E20 & D19 Pin placement; compared to the previous version; GTM/ASC3/LVDS/HSCT/QSPI2,3
- (in symbol SAL-TC377TP-96F300S AA, part L) Port 22 & 23; GTM/ASC3/LVDS/HSCT/QSPI2,3
- (in symbol SAL-TC377TP-96F300S AA, part M) Port 32, 33 & 34; ASC2/GTM/SENT/DSADC/VADCMUX/CCU6

### Library data of the parts
R58 = R: 贴片电阻; 版权归属: 源创客; BOM名称: 贴片电阻; 学习资源: www.ooocke.com
U8 = SAL-TC377TP-96F300S AA: as U8 on sheet TC377TP_1; Manufacturer Order Number: SAL-TC377TP-96F300S AA; PackageReference: PG-LFBGA-292-11

## Nets that join several sheets
1.3V: OTHER (C70.1 IC2.12 L5.2), TC377TP_1 (24 pins)
3.3V: MOTOR_DRV (S2.1 U6.5), OTHER (40 pins), TC377TP_1 (28 pins), TC377TP_2 (R58.2)
+5V: MOTOR_DRV (C3.2 IC2.4), OTHER (14 pins), TC377TP_1 (LB2.1)
CORE_GND: BAT (5 pins), MOTOR_DRV (7 pins), OTHER (70 pins), TC377TP_1 (91 pins)
PGND: MOTOR_DRV (22 pins), OTHER (RC1.2)
VIN: BAT (R1.1 SP.2), MOTOR_DRV (26 pins), OTHER (LB4.1 TP3.1)
ADC_IN1: MOTOR_DRV (R62.1), TC377TP_2 (U8.T10)
ADC_IN2: MOTOR_DRV (R74.1), TC377TP_2 (U8.W8)
ADC_IN3: BAT (R6.1), TC377TP_2 (U8.W5)
ADC_IN4: OTHER (R92.1), TC377TP_2 (U8.W2)
ATOM1_CH3_P10_3: OTHER (JP7.3), TC377TP_2 (U8.A6)
ATOM1_CH5_P20_9: MOTOR_DRV (U3.2), TC377TP_2 (U8.E17)
ATOM1_CH7_P15_4: OTHER (1.8 JP-LCD.8), TC377TP_2 (U8.A17)
ATOM2_CH1_P20_13: MOTOR_DRV (U5.2), TC377TP_2 (U8.D20)
ATOM2_CH6_P20_10: MOTOR_DRV (U4.2), TC377TP_2 (U8.E19)
ATOM2_CH7_P20_7: MOTOR_DRV (U2.2), TC377TP_2 (U8.F19)
GPT12_T2EUDB_P33_6: OTHER (JP8.4 R82.1), TC377TP_2 (U8.W13)
GPT12_T2INB_P33_7: OTHER (JP8.3 R81.1), TC377TP_2 (U8.Y13)
GPT12_T6EUDA_P20_0: OTHER (JP9.4 R84.1), TC377TP_2 (U8.H20)
GPT12_T6INB_P10_2: OTHER (JP9.3 R83.1), TC377TP_2 (U8.A5)
HREF: OTHER (J1.5), TC377TP_2 (U8.D1)
P00_0: OTHER (J1.8), TC377TP_2 (U8.G1)
P00_1: OTHER (J1.9), TC377TP_2 (U8.G2)
P00_2: OTHER (J1.10), TC377TP_2 (U8.H1)
P00_3: OTHER (J1.11), TC377TP_2 (U8.H2)
P00_4: OTHER (J1.12), TC377TP_2 (U8.J1)
P00_5: OTHER (J1.13), TC377TP_2 (U8.J2)
P00_6: OTHER (J1.14), TC377TP_2 (U8.J4)
P00_7: OTHER (J1.15), TC377TP_2 (U8.K1)
P02_0: OTHER (J1.6), TC377TP_2 (U8.B1)
P02_1: OTHER (J1.1), TC377TP_2 (U8.C2)
P02_2: OTHER (J1.4), TC377TP_2 (U8.C1)
P02_3: OTHER (J1.3), TC377TP_2 (U8.D2)
P02_5: TC377TP_1 (LED7.2), TC377TP_2 (U8.E2)
P02_6: TC377TP_1 (LED6.2), TC377TP_2 (U8.E1)
P10_5: OTHER (wifi1.1), TC377TP_2 (U8.B5)
P10_6: OTHER (wifi1.2), TC377TP_2 (U8.A4)
P14_0: TC377TP_1 (JP5.7), TC377TP_2 (U8.B16)
P14_1: TC377TP_1 (JP5.9), TC377TP_2 (U8.A15)
P14_2: TC377TP_1 (R41.1), TC377TP_2 (U8.E13)
P14_3: TC377TP_1 (R42.1), TC377TP_2 (U8.B14)
P14_4: TC377TP_1 (R52.1), TC377TP_2 (U8.B15)
P14_5: TC377TP_1 (R40.1), TC377TP_2 (U8.A14)
P14_6: TC377TP_1 (R50.1), TC377TP_2 (U8.B13)
P15_0: OTHER (1.6 JP-LCD.6), TC377TP_2 (U8.B20)
P15_1: OTHER (1.5 JP-LCD.5), TC377TP_2 (U8.A18)
P15_2: OTHER (1.7 JP-LCD.7), TC377TP_2 (U8.C19)
P15_3: OTHER (1.3 JP-LCD.3), TC377TP_2 (U8.B17)
P15_5: OTHER (1.4 JP-LCD.4), TC377TP_2 (U8.E14)
P15_6: OTHER (bt1.4), TC377TP_2 (U8.A16)
P15_7: OTHER (bt1.3), TC377TP_2 (U8.D15)
P20_12: MOTOR_DRV (R45.2), TC377TP_2 (U8.D19)
P22_0: OTHER (R87.1 U12.2), TC377TP_2 (U8.P20)
P22_2: OTHER (R86.1 U12.3), TC377TP_2 (U8.R20)
P23_4: OTHER (U12.5), TC377TP_2 (U8.T20)
P32_2: OTHER (R68.2 SW2.3), TC377TP_2 (U8.Y18)
P32_3: OTHER (R66.2 SW2.1), TC377TP_2 (U8.Y19)
P32_4: OTHER (R67.2 SW2.2), TC377TP_2 (U8.W18)
P33_1: OTHER (R78.2), TC377TP_2 (U8.Y10)
P33_9: OTHER (R72.2 SW3.1), TC377TP_2 (U8.Y14)
P33_11: OTHER (R73.2 SW4.1), TC377TP_2 (U8.Y15)
P33_13: OTHER (R69.2 SW2.4), TC377TP_2 (U8.Y16)